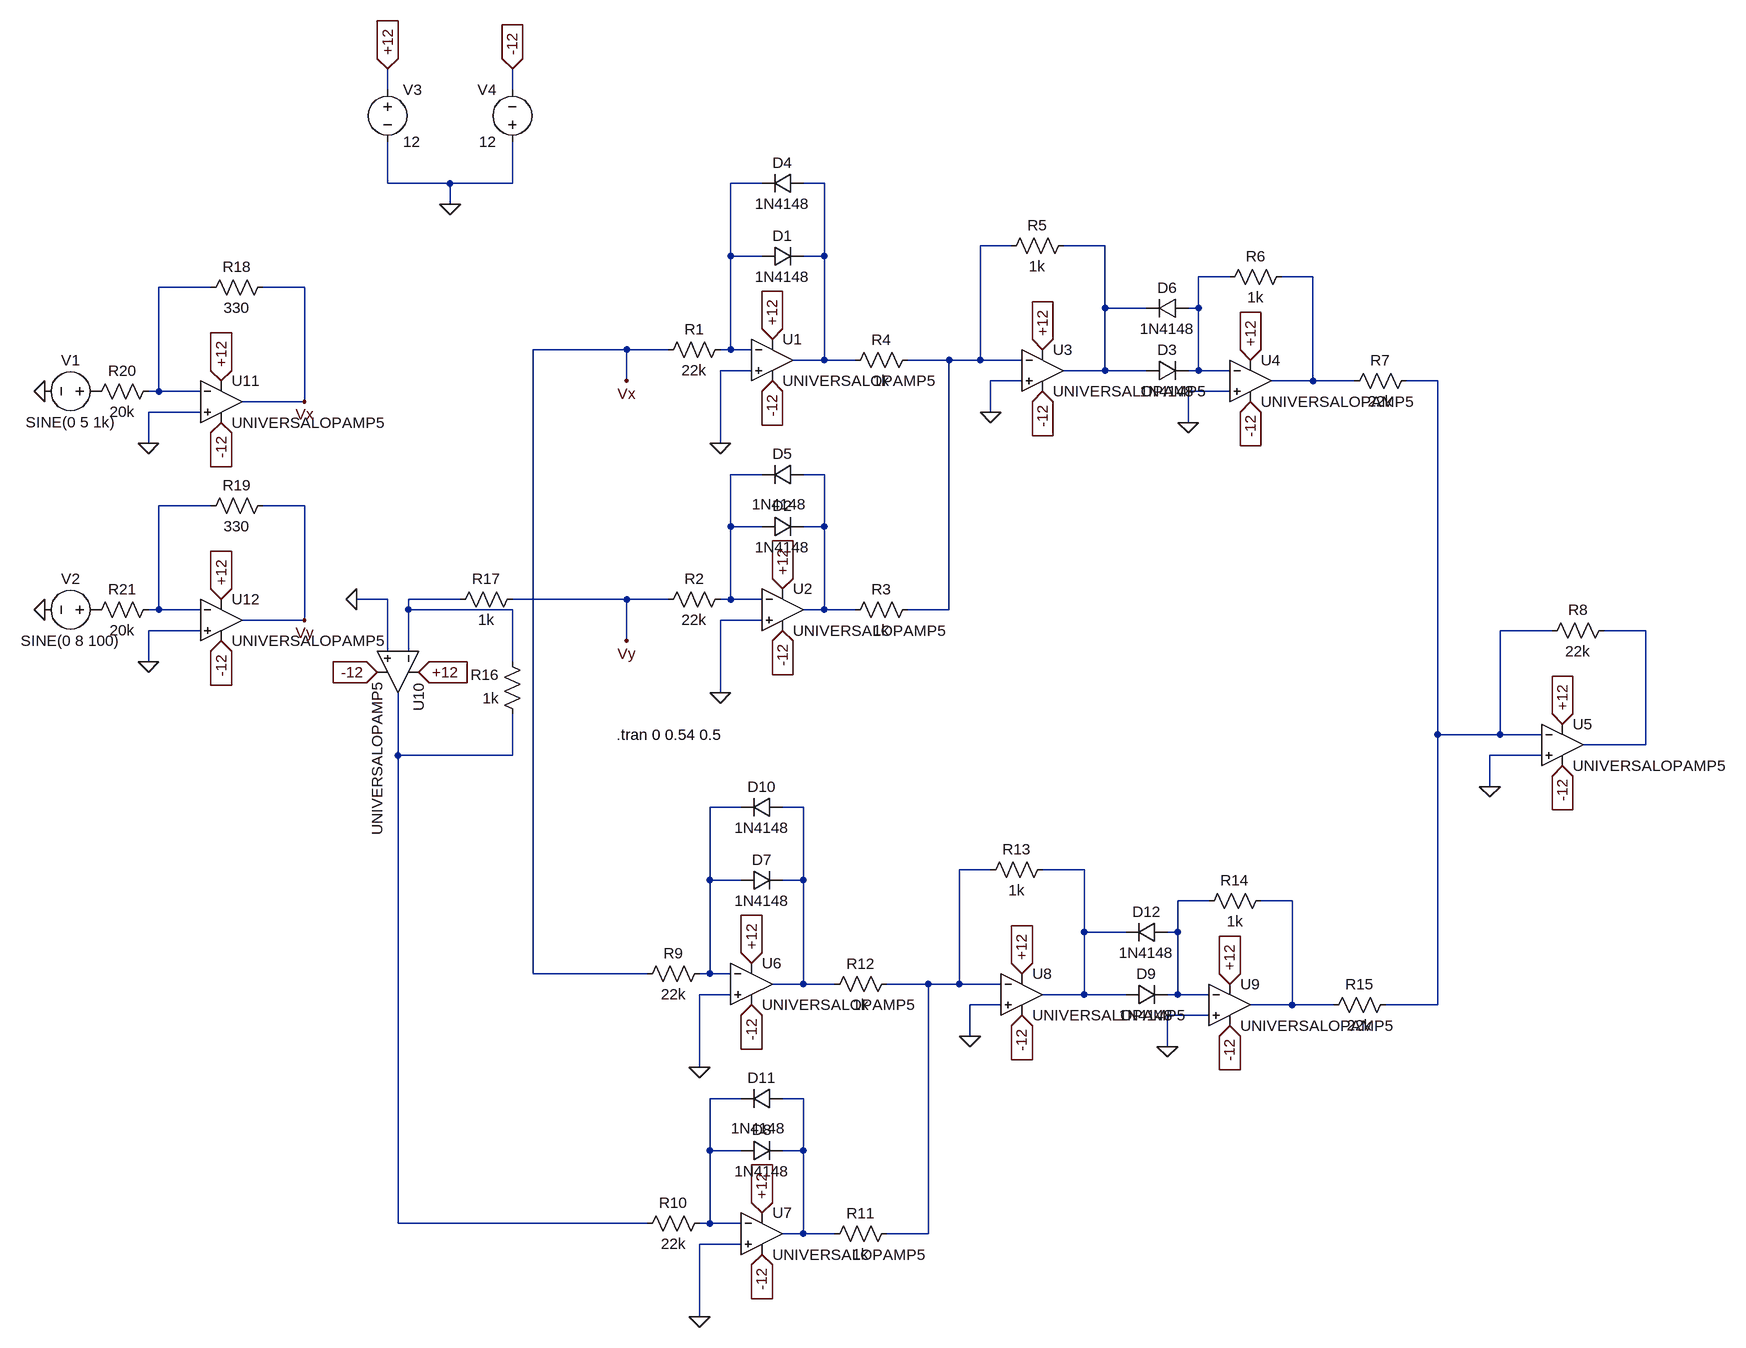
[diagram p0: schematic Logarithmic multiplier.asc]
Logarithmic multiplier.asc, the LTspice schematic file:
Version 4.1
SHEET 1 1204 1304
WIRE -736 -624 -736 -656
WIRE -544 -624 -544 -656
WIRE -736 -480 -736 -544
WIRE -640 -480 -736 -480
WIRE -544 -480 -544 -544
WIRE -544 -480 -640 -480
WIRE -160 -480 -208 -480
WIRE -64 -480 -96 -480
WIRE -640 -448 -640 -480
WIRE 224 -384 176 -384
WIRE 368 -384 304 -384
WIRE -208 -368 -208 -480
WIRE -160 -368 -208 -368
WIRE -64 -368 -64 -480
WIRE -64 -368 -96 -368
WIRE 560 -336 512 -336
WIRE 688 -336 640 -336
WIRE -1008 -320 -1088 -320
WIRE -864 -320 -928 -320
WIRE 368 -288 368 -384
WIRE 432 -288 368 -288
WIRE 512 -288 512 -336
WIRE 512 -288 496 -288
WIRE -368 -224 -512 -224
WIRE -304 -224 -368 -224
WIRE -208 -224 -208 -368
WIRE -208 -224 -224 -224
WIRE -176 -224 -208 -224
WIRE -64 -208 -64 -368
WIRE -64 -208 -112 -208
WIRE -16 -208 -64 -208
WIRE 128 -208 64 -208
WIRE 176 -208 176 -384
WIRE 176 -208 128 -208
WIRE 240 -208 176 -208
WIRE -176 -192 -224 -192
WIRE 368 -192 368 -288
WIRE 368 -192 304 -192
WIRE 432 -192 368 -192
WIRE 512 -192 512 -288
WIRE 512 -192 496 -192
WIRE 560 -192 512 -192
WIRE -368 -176 -368 -224
WIRE 240 -176 192 -176
WIRE 688 -176 688 -336
WIRE 688 -176 624 -176
WIRE 752 -176 688 -176
WIRE 880 -176 832 -176
WIRE -1088 -160 -1088 -320
WIRE -1088 -160 -1104 -160
WIRE -1024 -160 -1088 -160
WIRE 560 -160 496 -160
WIRE -864 -144 -864 -320
WIRE -864 -144 -960 -144
WIRE -1024 -128 -1104 -128
WIRE 192 -128 192 -176
WIRE 496 -112 496 -160
WIRE -1104 -80 -1104 -128
WIRE -224 -80 -224 -192
WIRE -160 -32 -208 -32
WIRE -64 -32 -96 -32
WIRE -1008 16 -1088 16
WIRE -864 16 -928 16
WIRE -208 48 -208 -32
WIRE -160 48 -208 48
WIRE -64 48 -64 -32
WIRE -64 48 -96 48
WIRE -736 160 -784 160
WIRE -624 160 -704 160
WIRE -368 160 -544 160
WIRE -304 160 -368 160
WIRE -208 160 -208 48
WIRE -208 160 -224 160
WIRE -160 160 -208 160
WIRE -1088 176 -1088 16
WIRE -1088 176 -1104 176
WIRE -1024 176 -1088 176
WIRE -704 176 -704 160
WIRE -544 176 -704 176
WIRE -64 176 -64 48
WIRE -64 176 -96 176
WIRE -16 176 -64 176
WIRE 128 176 128 -208
WIRE 128 176 64 176
WIRE -864 192 -864 16
WIRE -864 192 -960 192
WIRE -160 192 -224 192
WIRE -1024 208 -1104 208
WIRE 1056 208 976 208
WIRE 1200 208 1136 208
WIRE -368 224 -368 160
WIRE -736 240 -736 160
WIRE -704 240 -704 176
WIRE -1104 256 -1104 208
WIRE -544 256 -544 176
WIRE -224 304 -224 192
WIRE 880 368 880 -176
WIRE 976 368 976 208
WIRE 976 368 880 368
WIRE 1040 368 976 368
WIRE 1200 384 1200 208
WIRE 1200 384 1104 384
WIRE -720 400 -720 304
WIRE -544 400 -544 336
WIRE -544 400 -720 400
WIRE 1040 400 960 400
WIRE 960 448 960 400
WIRE -192 480 -240 480
WIRE -96 480 -128 480
WIRE 192 576 144 576
WIRE 336 576 272 576
WIRE -240 592 -240 480
WIRE -192 592 -240 592
WIRE -96 592 -96 480
WIRE -96 592 -128 592
WIRE 528 624 480 624
WIRE 656 624 608 624
WIRE 336 672 336 576
WIRE 400 672 336 672
WIRE 480 672 480 624
WIRE 480 672 464 672
WIRE -512 736 -512 -224
WIRE -336 736 -512 736
WIRE -240 736 -240 592
WIRE -240 736 -256 736
WIRE -208 736 -240 736
WIRE -96 752 -96 592
WIRE -96 752 -144 752
WIRE -48 752 -96 752
WIRE 96 752 32 752
WIRE 144 752 144 576
WIRE 144 752 96 752
WIRE 208 752 144 752
WIRE -208 768 -256 768
WIRE 336 768 336 672
WIRE 336 768 272 768
WIRE 400 768 336 768
WIRE 480 768 480 672
WIRE 480 768 464 768
WIRE 528 768 480 768
WIRE 208 784 160 784
WIRE 656 784 656 624
WIRE 656 784 592 784
WIRE 720 784 656 784
WIRE 880 784 880 368
WIRE 880 784 800 784
WIRE 528 800 464 800
WIRE 160 832 160 784
WIRE 464 848 464 800
WIRE -256 880 -256 768
WIRE -192 928 -240 928
WIRE -96 928 -128 928
WIRE -240 1008 -240 928
WIRE -192 1008 -240 1008
WIRE -96 1008 -96 928
WIRE -96 1008 -128 1008
WIRE -720 1120 -720 400
WIRE -336 1120 -720 1120
WIRE -240 1120 -240 1008
WIRE -240 1120 -256 1120
WIRE -192 1120 -240 1120
WIRE -96 1136 -96 1008
WIRE -96 1136 -128 1136
WIRE -48 1136 -96 1136
WIRE 96 1136 96 752
WIRE 96 1136 32 1136
WIRE -192 1152 -256 1152
WIRE -256 1264 -256 1152
FLAG -224 -80 0
FLAG -224 304 0
FLAG 192 -128 0
FLAG 496 -112 0
FLAG 960 448 0
FLAG -640 -448 0
FLAG -736 -656 +12
IOPIN -736 -656 In
FLAG -544 -656 -12
IOPIN -544 -656 In
FLAG -128 208 -12
IOPIN -128 208 In
FLAG -144 -176 -12
IOPIN -144 -176 In
FLAG 272 -160 -12
IOPIN 272 -160 In
FLAG 1072 416 -12
IOPIN 1072 416 In
FLAG 592 -144 -12
IOPIN 592 -144 In
FLAG -128 144 +12
IOPIN -128 144 In
FLAG -144 -240 +12
IOPIN -144 -240 In
FLAG 272 -224 +12
IOPIN 272 -224 In
FLAG 592 -208 +12
IOPIN 592 -208 In
FLAG 1072 352 +12
IOPIN 1072 352 In
FLAG -256 880 0
FLAG -256 1264 0
FLAG 160 832 0
FLAG 464 848 0
FLAG -160 1168 -12
IOPIN -160 1168 In
FLAG -176 784 -12
IOPIN -176 784 In
FLAG 240 800 -12
IOPIN 240 800 In
FLAG 560 816 -12
IOPIN 560 816 In
FLAG -160 1104 +12
IOPIN -160 1104 In
FLAG -176 720 +12
IOPIN -176 720 In
FLAG 240 736 +12
IOPIN 240 736 In
FLAG 560 752 +12
IOPIN 560 752 In
FLAG -784 160 0
FLAG -752 272 -12
IOPIN -752 272 In
FLAG -688 272 +12
IOPIN -688 272 In
FLAG -1104 -80 0
FLAG -992 -112 -12
IOPIN -992 -112 In
FLAG -992 -176 +12
IOPIN -992 -176 In
FLAG -1104 256 0
FLAG -992 224 -12
IOPIN -992 224 In
FLAG -992 160 +12
IOPIN -992 160 In
FLAG -1264 -160 0
FLAG -1264 176 0
FLAG -864 -144 Vx
FLAG -368 -176 Vx
FLAG -864 192 Vy
FLAG -368 224 Vy
SYMBOL res -208 -240 R90
WINDOW 0 0 56 VBottom 2
WINDOW 3 32 56 VTop 2
SYMATTR InstName R1
SYMATTR Value 22k
SYMBOL res -208 144 R90
WINDOW 0 0 56 VBottom 2
WINDOW 3 32 56 VTop 2
SYMATTR InstName R2
SYMATTR Value 22k
SYMBOL diode -160 -352 R270
WINDOW 0 32 32 VTop 2
WINDOW 3 0 32 VBottom 2
SYMATTR InstName D1
SYMATTR Value 1N4148
SYMBOL diode -160 64 R270
WINDOW 0 32 32 VTop 2
WINDOW 3 0 32 VBottom 2
SYMATTR InstName D2
SYMATTR Value 1N4148
SYMBOL OpAmps\\UniversalOpAmp5 -144 -208 R0
SYMATTR InstName U1
SYMBOL OpAmps\\UniversalOpAmp5 -128 176 R0
SYMATTR InstName U2
SYMBOL res 80 160 R90
WINDOW 0 0 56 VBottom 2
WINDOW 3 32 56 VTop 2
SYMATTR InstName R3
SYMATTR Value 1k
SYMBOL res 80 -224 R90
WINDOW 0 0 56 VBottom 2
WINDOW 3 32 56 VTop 2
SYMATTR InstName R4
SYMATTR Value 1k
SYMBOL OpAmps\\UniversalOpAmp5 272 -192 R0
SYMATTR InstName U3
SYMBOL res 320 -400 R90
WINDOW 0 0 56 VBottom 2
WINDOW 3 32 56 VTop 2
SYMATTR InstName R5
SYMATTR Value 1k
SYMBOL diode 432 -176 R270
WINDOW 0 32 32 VTop 2
WINDOW 3 0 32 VBottom 2
SYMATTR InstName D3
SYMATTR Value 1N4148
SYMBOL OpAmps\\UniversalOpAmp5 592 -176 R0
SYMATTR InstName U4
SYMBOL res 656 -352 R90
WINDOW 0 0 56 VBottom 2
WINDOW 3 32 56 VTop 2
SYMATTR InstName R6
SYMATTR Value 1k
SYMBOL res 848 -192 R90
WINDOW 0 0 56 VBottom 2
WINDOW 3 32 56 VTop 2
SYMATTR InstName R7
SYMATTR Value 22k
SYMBOL res 1152 192 R90
WINDOW 0 0 56 VBottom 2
WINDOW 3 32 56 VTop 2
SYMATTR InstName R8
SYMATTR Value 22k
SYMBOL OpAmps\\UniversalOpAmp5 1072 384 R0
SYMATTR InstName U5
SYMBOL voltage -736 -640 R0
WINDOW 123 0 0 Left 0
WINDOW 39 0 0 Left 0
SYMATTR InstName V3
SYMATTR Value 12
SYMBOL voltage -544 -528 R180
WINDOW 0 24 96 Left 2
WINDOW 3 24 16 Left 2
WINDOW 123 0 0 Left 0
WINDOW 39 0 0 Left 0
SYMATTR InstName V4
SYMATTR Value 12
SYMBOL diode -96 -496 R90
WINDOW 0 0 32 VBottom 2
WINDOW 3 32 32 VTop 2
SYMATTR InstName D4
SYMATTR Value 1N4148
SYMBOL diode -96 -48 R90
WINDOW 0 0 32 VBottom 2
WINDOW 3 46 37 VTop 2
SYMATTR InstName D5
SYMATTR Value 1N4148
SYMBOL diode 496 -304 R90
WINDOW 0 0 32 VBottom 2
WINDOW 3 32 32 VTop 2
SYMATTR InstName D6
SYMATTR Value 1N4148
SYMBOL res -240 720 R90
WINDOW 0 0 56 VBottom 2
WINDOW 3 32 56 VTop 2
SYMATTR InstName R9
SYMATTR Value 22k
SYMBOL res -240 1104 R90
WINDOW 0 0 56 VBottom 2
WINDOW 3 32 56 VTop 2
SYMATTR InstName R10
SYMATTR Value 22k
SYMBOL diode -192 608 R270
WINDOW 0 32 32 VTop 2
WINDOW 3 0 32 VBottom 2
SYMATTR InstName D7
SYMATTR Value 1N4148
SYMBOL diode -192 1024 R270
WINDOW 0 32 32 VTop 2
WINDOW 3 0 32 VBottom 2
SYMATTR InstName D8
SYMATTR Value 1N4148
SYMBOL OpAmps\\UniversalOpAmp5 -176 752 R0
SYMATTR InstName U6
SYMBOL OpAmps\\UniversalOpAmp5 -160 1136 R0
SYMATTR InstName U7
SYMBOL res 48 1120 R90
WINDOW 0 0 56 VBottom 2
WINDOW 3 32 56 VTop 2
SYMATTR InstName R11
SYMATTR Value 1k
SYMBOL res 48 736 R90
WINDOW 0 0 56 VBottom 2
WINDOW 3 32 56 VTop 2
SYMATTR InstName R12
SYMATTR Value 1k
SYMBOL OpAmps\\UniversalOpAmp5 240 768 R0
SYMATTR InstName U8
SYMBOL res 288 560 R90
WINDOW 0 0 56 VBottom 2
WINDOW 3 32 56 VTop 2
SYMATTR InstName R13
SYMATTR Value 1k
SYMBOL diode 400 784 R270
WINDOW 0 32 32 VTop 2
WINDOW 3 0 32 VBottom 2
SYMATTR InstName D9
SYMATTR Value 1N4148
SYMBOL OpAmps\\UniversalOpAmp5 560 784 R0
SYMATTR InstName U9
SYMBOL res 624 608 R90
WINDOW 0 0 56 VBottom 2
WINDOW 3 32 56 VTop 2
SYMATTR InstName R14
SYMATTR Value 1k
SYMBOL res 816 768 R90
WINDOW 0 0 56 VBottom 2
WINDOW 3 32 56 VTop 2
SYMATTR InstName R15
SYMATTR Value 22k
SYMBOL diode -128 464 R90
WINDOW 0 0 32 VBottom 2
WINDOW 3 32 32 VTop 2
SYMATTR InstName D10
SYMATTR Value 1N4148
SYMBOL diode -128 912 R90
WINDOW 0 0 32 VBottom 2
WINDOW 3 46 37 VTop 2
SYMATTR InstName D11
SYMATTR Value 1N4148
SYMBOL diode 464 656 R90
WINDOW 0 0 32 VBottom 2
WINDOW 3 32 32 VTop 2
SYMATTR InstName D12
SYMATTR Value 1N4148
SYMBOL res -528 352 R180
WINDOW 0 36 76 Left 2
WINDOW 3 36 40 Left 2
SYMATTR InstName R16
SYMATTR Value 1k
SYMBOL OpAmps\\UniversalOpAmp5 -720 272 R90
SYMATTR InstName U10
SYMBOL res -528 144 R90
WINDOW 0 0 56 VBottom 2
WINDOW 3 32 56 VTop 2
SYMATTR InstName R17
SYMATTR Value 1k
SYMBOL OpAmps\\UniversalOpAmp5 -992 -144 R0
SYMATTR InstName U11
SYMBOL OpAmps\\UniversalOpAmp5 -992 192 R0
SYMATTR InstName U12
SYMBOL res -912 -336 R90
WINDOW 0 0 56 VBottom 2
WINDOW 3 32 56 VTop 2
SYMATTR InstName R18
SYMATTR Value 330
SYMBOL res -912 0 R90
WINDOW 0 0 56 VBottom 2
WINDOW 3 32 56 VTop 2
SYMATTR InstName R19
SYMATTR Value 330
SYMBOL res -1088 -176 R90
WINDOW 0 0 56 VBottom 2
WINDOW 3 32 56 VTop 2
SYMATTR InstName R20
SYMATTR Value 20k
SYMBOL res -1088 160 R90
WINDOW 0 0 56 VBottom 2
WINDOW 3 32 56 VTop 2
SYMATTR InstName R21
SYMATTR Value 20k
SYMBOL voltage -1168 -160 R90
WINDOW 0 -32 56 VBottom 2
WINDOW 3 32 56 VTop 2
WINDOW 123 0 0 Left 0
WINDOW 39 0 0 Left 0
SYMATTR InstName V1
SYMATTR Value SINE(0 5 1k)
SYMBOL voltage -1168 176 R90
WINDOW 0 -32 56 VBottom 2
WINDOW 3 32 56 VTop 2
WINDOW 123 0 0 Left 0
WINDOW 39 0 0 Left 0
SYMATTR InstName V2
SYMATTR Value SINE(0 8 100)
TEXT -384 368 Left 2 !.tran 0 0.54 0.5

The netlist it stands for:
* Logarithmic multiplier.asc
R1 N001 Vx 22k
R2 N009 Vy 22k
D1 N001 N002 1N4148
D2 N009 N010 1N4148
X§U1 0 N001 +12 -12 N002 level5 Avol=1Meg GBW=10Meg Phimargin=45 SlewPos=10Meg SlewNeg=10Meg En=0 Enk=0 In=0 Ink=0 Rcm=500Meg Ccm=1p Rdiff=500k Cdiff=2p Ro=1k Vos=0 Ibp=2n Ibn=1n Iq=1m Rail=0 Ilimit=25m  ; UNIVERSALOPAMP5, pins In+ In- V+ V- OUT
X§U2 0 N009 +12 -12 N010 level5 Avol=1Meg GBW=10Meg Phimargin=45 SlewPos=10Meg SlewNeg=10Meg En=0 Enk=0 In=0 Ink=0 Rcm=500Meg Ccm=1p Rdiff=500k Cdiff=2p Ro=1k Vos=0 Ibp=2n Ibn=1n Iq=1m Rail=0 Ilimit=25m  ; UNIVERSALOPAMP5, pins In+ In- V+ V- OUT
R3 N003 N010 1k
R4 N003 N002 1k
X§U3 0 N003 +12 -12 N004 level5 Avol=1Meg GBW=10Meg Phimargin=45 SlewPos=10Meg SlewNeg=10Meg En=0 Enk=0 In=0 Ink=0 Rcm=500Meg Ccm=1p Rdiff=500k Cdiff=2p Ro=1k Vos=0 Ibp=2n Ibn=1n Iq=1m Rail=0 Ilimit=25m  ; UNIVERSALOPAMP5, pins In+ In- V+ V- OUT
R5 N004 N003 1k
D3 N004 N005 1N4148
X§U4 0 N005 +12 -12 N006 level5 Avol=1Meg GBW=10Meg Phimargin=45 SlewPos=10Meg SlewNeg=10Meg En=0 Enk=0 In=0 Ink=0 Rcm=500Meg Ccm=1p Rdiff=500k Cdiff=2p Ro=1k Vos=0 Ibp=2n Ibn=1n Iq=1m Rail=0 Ilimit=25m  ; UNIVERSALOPAMP5, pins In+ In- V+ V- OUT
R6 N006 N005 1k
R7 N008 N006 22k
R8 N013 N008 22k
X§U5 0 N008 +12 -12 N013 level5 Avol=1Meg GBW=10Meg Phimargin=45 SlewPos=10Meg SlewNeg=10Meg En=0 Enk=0 In=0 Ink=0 Rcm=500Meg Ccm=1p Rdiff=500k Cdiff=2p Ro=1k Vos=0 Ibp=2n Ibn=1n Iq=1m Rail=0 Ilimit=25m  ; UNIVERSALOPAMP5, pins In+ In- V+ V- OUT
V3 +12 0 12
V4 0 -12 12
D4 N002 N001 1N4148
D5 N010 N009 1N4148
D6 N005 N004 1N4148
R9 N015 Vx 22k
R10 N021 N014 22k
D7 N015 N016 1N4148
D8 N021 N022 1N4148
X§U6 0 N015 +12 -12 N016 level5 Avol=1Meg GBW=10Meg Phimargin=45 SlewPos=10Meg SlewNeg=10Meg En=0 Enk=0 In=0 Ink=0 Rcm=500Meg Ccm=1p Rdiff=500k Cdiff=2p Ro=1k Vos=0 Ibp=2n Ibn=1n Iq=1m Rail=0 Ilimit=25m  ; UNIVERSALOPAMP5, pins In+ In- V+ V- OUT
X§U7 0 N021 +12 -12 N022 level5 Avol=1Meg GBW=10Meg Phimargin=45 SlewPos=10Meg SlewNeg=10Meg En=0 Enk=0 In=0 Ink=0 Rcm=500Meg Ccm=1p Rdiff=500k Cdiff=2p Ro=1k Vos=0 Ibp=2n Ibn=1n Iq=1m Rail=0 Ilimit=25m  ; UNIVERSALOPAMP5, pins In+ In- V+ V- OUT
R11 N017 N022 1k
R12 N017 N016 1k
X§U8 0 N017 +12 -12 N018 level5 Avol=1Meg GBW=10Meg Phimargin=45 SlewPos=10Meg SlewNeg=10Meg En=0 Enk=0 In=0 Ink=0 Rcm=500Meg Ccm=1p Rdiff=500k Cdiff=2p Ro=1k Vos=0 Ibp=2n Ibn=1n Iq=1m Rail=0 Ilimit=25m  ; UNIVERSALOPAMP5, pins In+ In- V+ V- OUT
R13 N018 N017 1k
D9 N018 N019 1N4148
X§U9 0 N019 +12 -12 N020 level5 Avol=1Meg GBW=10Meg Phimargin=45 SlewPos=10Meg SlewNeg=10Meg En=0 Enk=0 In=0 Ink=0 Rcm=500Meg Ccm=1p Rdiff=500k Cdiff=2p Ro=1k Vos=0 Ibp=2n Ibn=1n Iq=1m Rail=0 Ilimit=25m  ; UNIVERSALOPAMP5, pins In+ In- V+ V- OUT
R14 N020 N019 1k
R15 N008 N020 22k
D10 N016 N015 1N4148
D11 N022 N021 1N4148
D12 N019 N018 1N4148
R16 N014 N012 1k
X§U10 0 N012 +12 -12 N014 level5 Avol=1Meg GBW=10Meg Phimargin=45 SlewPos=10Meg SlewNeg=10Meg En=0 Enk=0 In=0 Ink=0 Rcm=500Meg Ccm=1p Rdiff=500k Cdiff=2p Ro=1k Vos=0 Ibp=2n Ibn=1n Iq=1m Rail=0 Ilimit=25m  ; UNIVERSALOPAMP5, pins In+ In- V+ V- OUT
R17 Vy N012 1k
X§U11 0 N007 +12 -12 Vx level5 Avol=1Meg GBW=10Meg Phimargin=45 SlewPos=10Meg SlewNeg=10Meg En=0 Enk=0 In=0 Ink=0 Rcm=500Meg Ccm=1p Rdiff=500k Cdiff=2p Ro=1k Vos=0 Ibp=2n Ibn=1n Iq=1m Rail=0 Ilimit=25m  ; UNIVERSALOPAMP5, pins In+ In- V+ V- OUT
X§U12 0 N011 +12 -12 Vy level5 Avol=1Meg GBW=10Meg Phimargin=45 SlewPos=10Meg SlewNeg=10Meg En=0 Enk=0 In=0 Ink=0 Rcm=500Meg Ccm=1p Rdiff=500k Cdiff=2p Ro=1k Vos=0 Ibp=2n Ibn=1n Iq=1m Rail=0 Ilimit=25m  ; UNIVERSALOPAMP5, pins In+ In- V+ V- OUT
R18 Vx N007 330
R19 Vy N011 330
R20 N007 P001 20k
R21 N011 P002 20k
V1 P001 0 SINE(0 5 1k)
V2 P002 0 SINE(0 8 100)
.model D D
.lib standard.dio
.tran 0 0.54 0.5
.backanno
.end